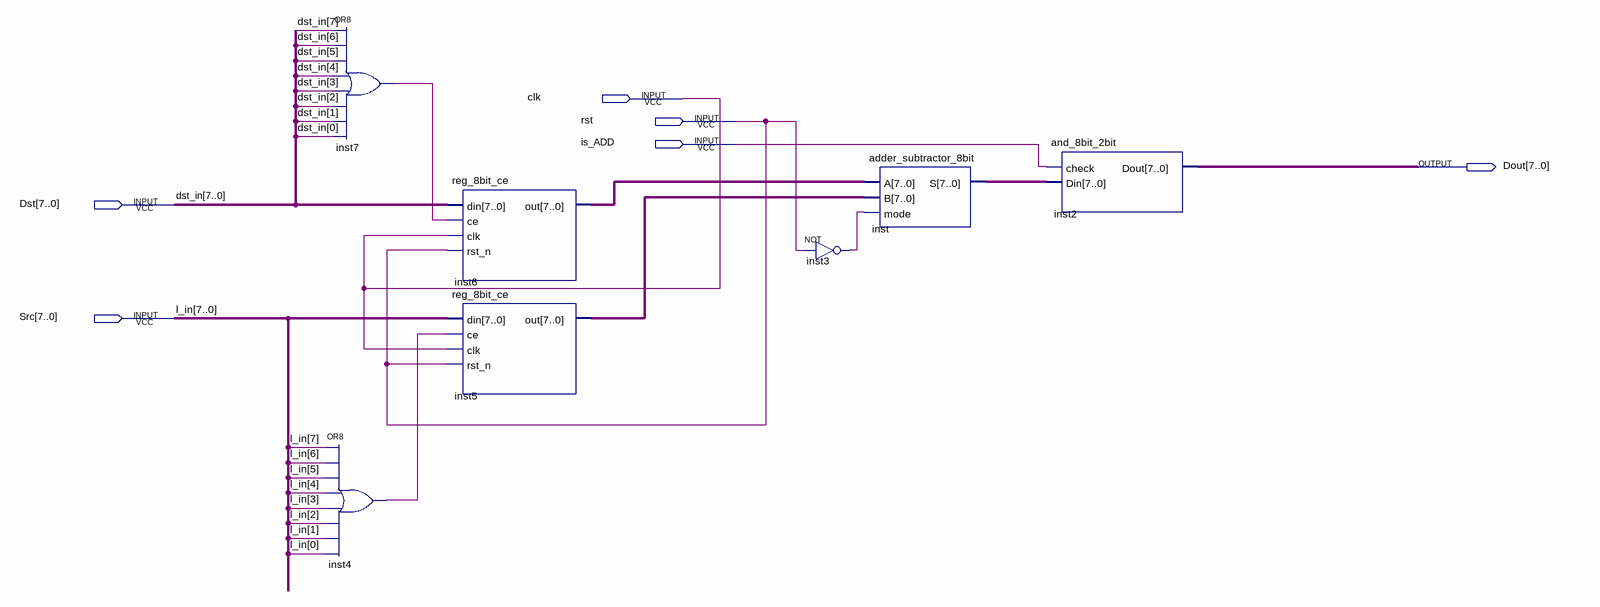
[diagram p0: schematic sheet]
// Quartus schematic add_module.bdf as structural Verilog: 7 symbols, 6 pins
module add_module (
  input  clk,
  input  rst,
  input  is_ADD,
  input  [7:0] Dst,
  input  [7:0] Src,
  output [7:0] Dout
);

  wire inst3_out, inst4_out, inst7_out;
  wire [7:0] inst5_out, inst6_out, inst_s;

  or inst7 (inst7_out, Dst[7], Dst[6], Dst[5], Dst[4], Dst[3], Dst[2], Dst[1], Dst[0]);
  or inst4 (inst4_out, Src[7], Src[6], Src[5], Src[4], Src[3], Src[2], Src[1], Src[0]);
  reg_8bit_ce inst6 (.din(Dst), .ce(inst7_out), .clk(clk), .rst_n(rst), .out(inst6_out));
  reg_8bit_ce inst5 (.din(Src), .ce(inst4_out), .clk(clk), .rst_n(rst), .out(inst5_out));
  not inst3 (inst3_out, rst);
  adder_subtractor_8bit inst (.A(inst6_out), .B(inst5_out), .mode(inst3_out), .S(inst_s));
  and_8bit_2bit inst2 (.check(is_ADD), .Din(inst_s), .Dout(Dout));

  // Other names for the same wires on the sheet: dst_in[7:0] = Dst; l_in[7:0] = Src
endmodule
